# EAGLE design CircuitClockHandLayout (EAGLE 9.4.2)
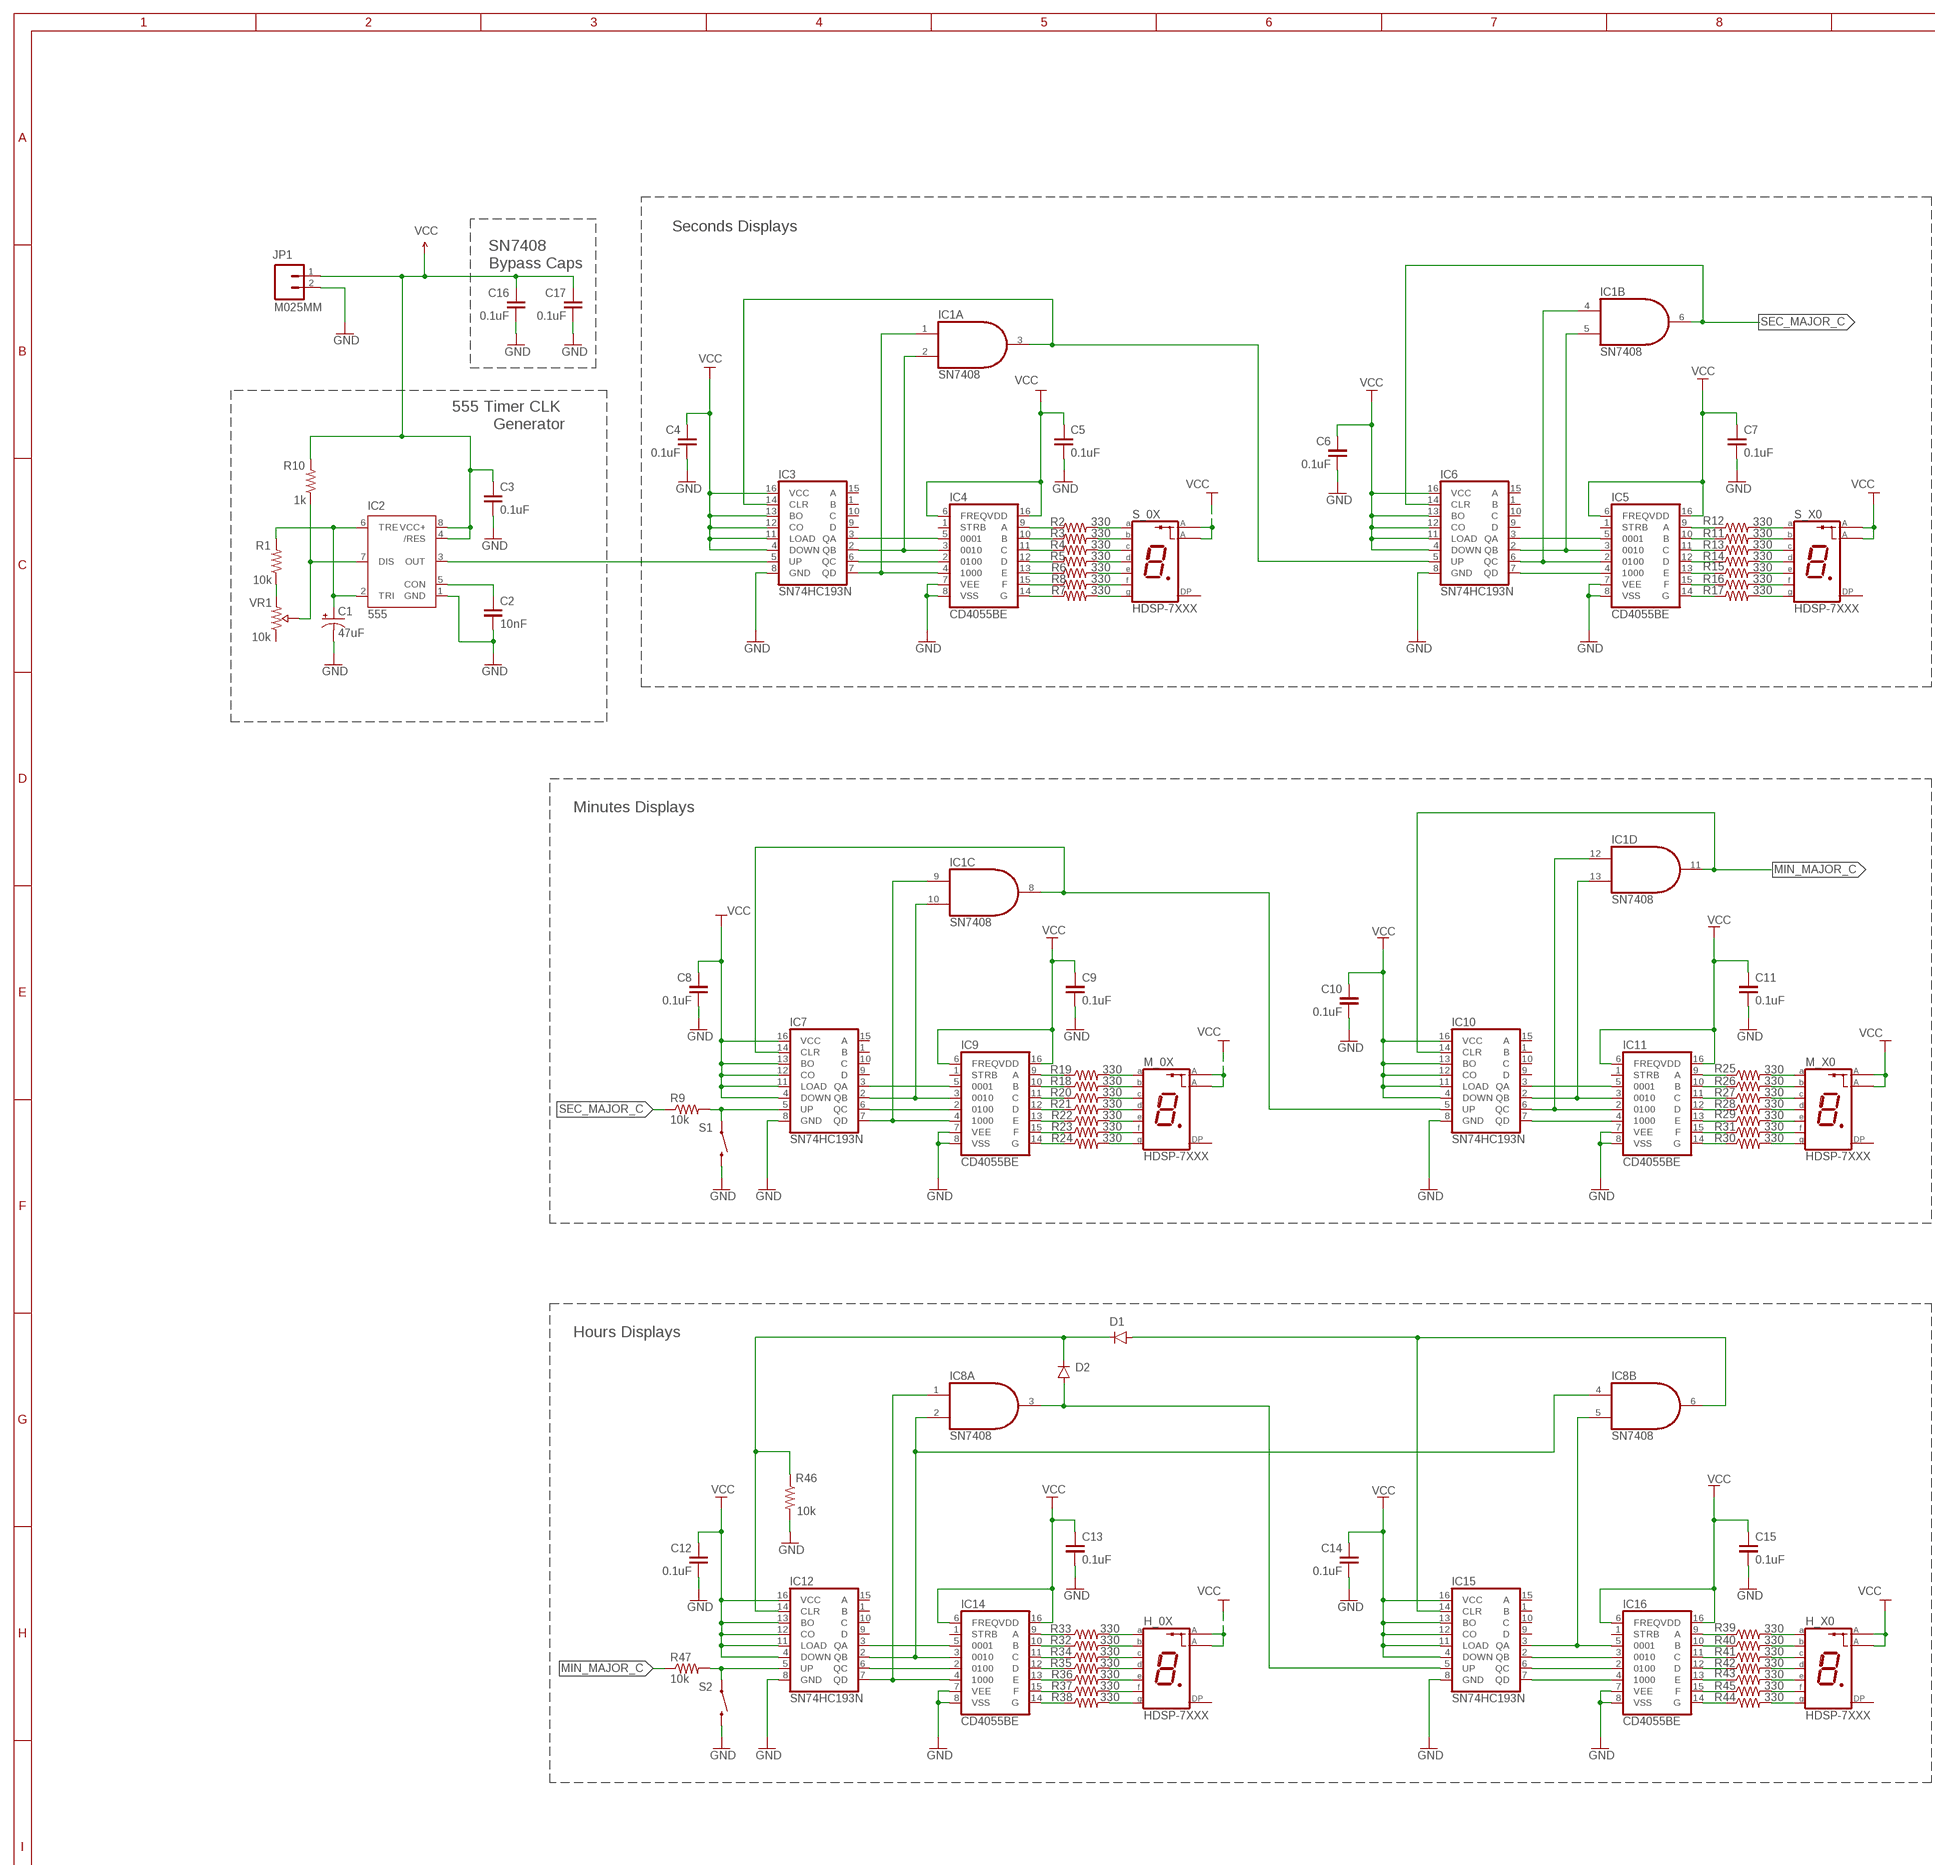
[diagram p0: schematic, sheet 1, part 1 of 2]
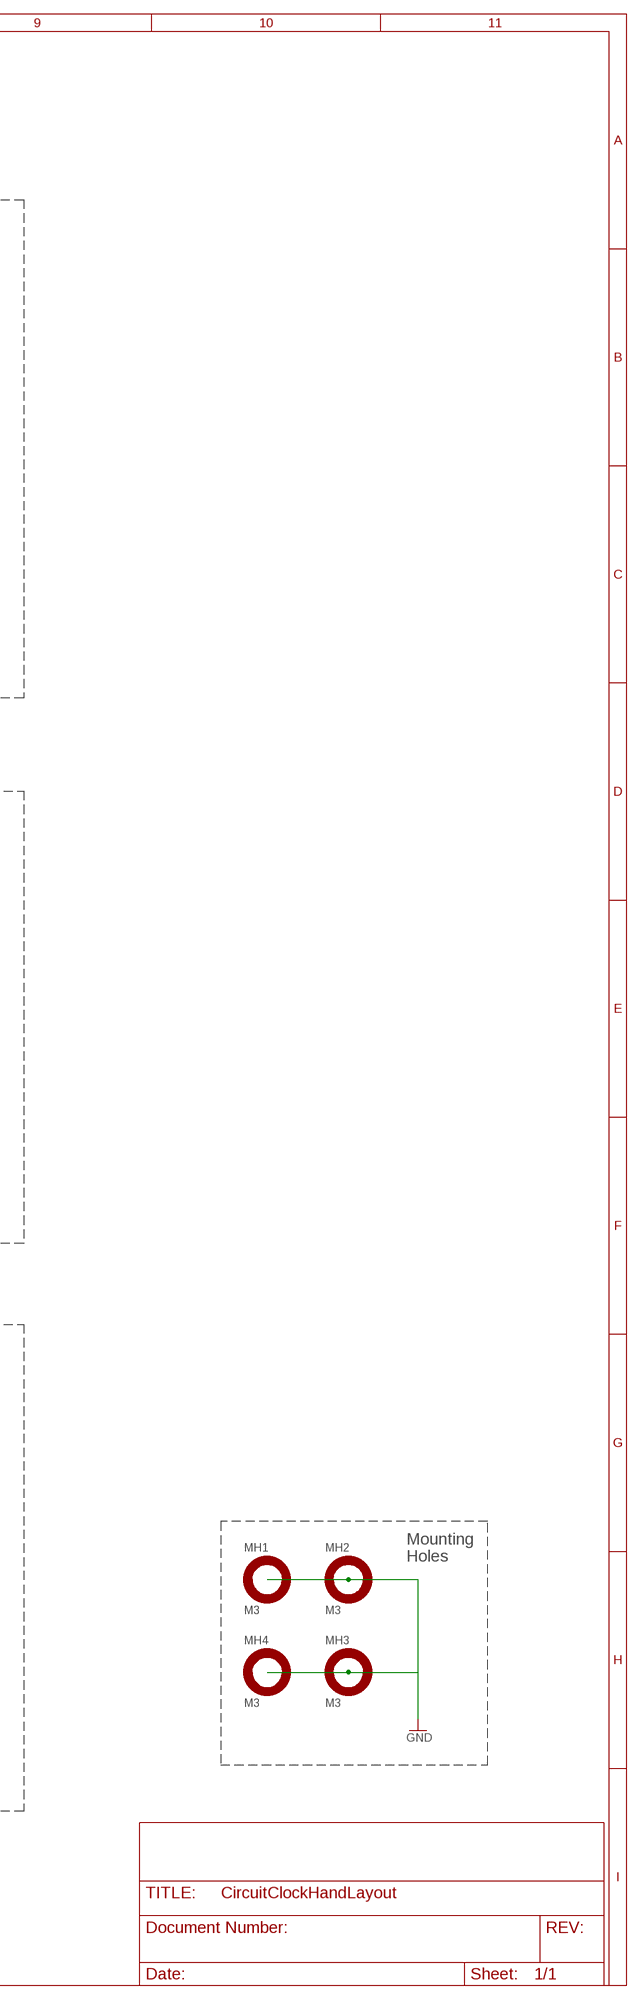
[diagram p1: schematic, sheet 1, part 2 of 2]
FRAME1 (FRAME_C_L): REV: 0

## Parts
C1  47uF  RADIAL_POL2.0MM_LEAD-5.0MM_DIA  [2.0MM_LEAD-5.0MM_DIA]
C2  10nF  NON_POL_2.5MM  [2.54MM_LEAD]
C3  0.1uF  NON_POL_2.5MM  [2.54MM_LEAD]
C4  0.1uF  NON_POL_2.5MM  [2.54MM_LEAD]
C5  0.1uF  NON_POL_2.5MM  [2.54MM_LEAD]
C6  0.1uF  NON_POL_2.5MM  [2.54MM_LEAD]
C7  0.1uF  NON_POL_2.5MM  [2.54MM_LEAD]
C8  0.1uF  NON_POL_2.5MM  [2.54MM_LEAD]
C9  0.1uF  NON_POL_2.5MM  [2.54MM_LEAD]
C10  0.1uF  NON_POL_2.5MM  [2.54MM_LEAD]
C11  0.1uF  NON_POL_2.5MM  [2.54MM_LEAD]
C12  0.1uF  NON_POL_2.5MM  [2.54MM_LEAD]
C13  0.1uF  NON_POL_2.5MM  [2.54MM_LEAD]
C14  0.1uF  NON_POL_2.5MM  [2.54MM_LEAD]
C15  0.1uF  NON_POL_2.5MM  [2.54MM_LEAD]
C16  0.1uF  NON_POL_2.5MM  [2.54MM_LEAD]
C17  0.1uF  NON_POL_2.5MM  [2.54MM_LEAD]
D1  THROUGH_HOLE_DO-35  [DO35-10]
D2  THROUGH_HOLE_DO-35  [DO35-10]
H_0X  HDSP-7XXX  [HDSP-7XXX]
H_X0  HDSP-7XXX  [HDSP-7XXX]
IC1  SN7408  74S08N  [DIL14]
IC2  555  555KIT  [DIP08-KIT]
IC3  SN74HC193N  [DIL16]
IC4  CD4055BE  [DIL16]
IC5  CD4055BE  [DIL16]
IC6  SN74HC193N  [DIL16]
IC7  SN74HC193N  [DIL16]
IC8  SN7408  74S08N  [DIL14]
IC9  CD4055BE  [DIL16]
IC10  SN74HC193N  [DIL16]
IC11  CD4055BE  [DIL16]
IC12  SN74HC193N  [DIL16]
IC14  CD4055BE  [DIL16]
IC15  SN74HC193N  [DIL16]
IC16  CD4055BE  [DIL16]
JP1  M025MM  [SCREWTERMINAL-5MM-2]
M_0X  HDSP-7XXX  [HDSP-7XXX]
M_X0  HDSP-7XXX  [HDSP-7XXX]
MH1  M3  MOUNT_HOLEM3  [M3]
MH2  M3  MOUNT_HOLEM3  [M3]
MH3  M3  MOUNT_HOLEM3  [M3]
MH4  M3  MOUNT_HOLEM3  [M3]
R1  10k  THROUGH_HOLE_1/4W_0.3  [1/4W_0.3]
R2  330  THROUGH_HOLE_1/4W_0.3  [1/4W_0.3]
R3  330  THROUGH_HOLE_1/4W_0.3  [1/4W_0.3]
R4  330  THROUGH_HOLE_1/4W_0.3  [1/4W_0.3]
R5  330  THROUGH_HOLE_1/4W_0.3  [1/4W_0.3]
R6  330  THROUGH_HOLE_1/4W_0.3  [1/4W_0.3]
R7  330  THROUGH_HOLE_1/4W_0.3  [1/4W_0.3]
R8  330  THROUGH_HOLE_1/4W_0.3  [1/4W_0.3]
R9  10k  THROUGH_HOLE_1/4W_0.3  [1/4W_0.3]
R10  1k  THROUGH_HOLE_1/4W_0.3  [1/4W_0.3]
R11  330  THROUGH_HOLE_1/4W_0.3  [1/4W_0.3]
R12  330  THROUGH_HOLE_1/4W_0.3  [1/4W_0.3]
R13  330  THROUGH_HOLE_1/4W_0.3  [1/4W_0.3]
R14  330  THROUGH_HOLE_1/4W_0.3  [1/4W_0.3]
R15  330  THROUGH_HOLE_1/4W_0.3  [1/4W_0.3]
R16  330  THROUGH_HOLE_1/4W_0.3  [1/4W_0.3]
R17  330  THROUGH_HOLE_1/4W_0.3  [1/4W_0.3]
R18  330  THROUGH_HOLE_1/4W_0.3  [1/4W_0.3]
R19  330  THROUGH_HOLE_1/4W_0.3  [1/4W_0.3]
R20  330  THROUGH_HOLE_1/4W_0.3  [1/4W_0.3]
R21  330  THROUGH_HOLE_1/4W_0.3  [1/4W_0.3]
R22  330  THROUGH_HOLE_1/4W_0.3  [1/4W_0.3]
R23  330  THROUGH_HOLE_1/4W_0.3  [1/4W_0.3]
R24  330  THROUGH_HOLE_1/4W_0.3  [1/4W_0.3]
R25  330  THROUGH_HOLE_1/4W_0.3  [1/4W_0.3]
R26  330  THROUGH_HOLE_1/4W_0.3  [1/4W_0.3]
R27  330  THROUGH_HOLE_1/4W_0.3  [1/4W_0.3]
R28  330  THROUGH_HOLE_1/4W_0.3  [1/4W_0.3]
R29  330  THROUGH_HOLE_1/4W_0.3  [1/4W_0.3]
R30  330  THROUGH_HOLE_1/4W_0.3  [1/4W_0.3]
R31  330  THROUGH_HOLE_1/4W_0.3  [1/4W_0.3]
R32  330  THROUGH_HOLE_1/4W_0.3  [1/4W_0.3]
R33  330  THROUGH_HOLE_1/4W_0.3  [1/4W_0.3]
R34  330  THROUGH_HOLE_1/4W_0.3  [1/4W_0.3]
R35  330  THROUGH_HOLE_1/4W_0.3  [1/4W_0.3]
R36  330  THROUGH_HOLE_1/4W_0.3  [1/4W_0.3]
R37  330  THROUGH_HOLE_1/4W_0.3  [1/4W_0.3]
R38  330  THROUGH_HOLE_1/4W_0.3  [1/4W_0.3]
R39  330  THROUGH_HOLE_1/4W_0.3  [1/4W_0.3]
R40  330  THROUGH_HOLE_1/4W_0.3  [1/4W_0.3]
R41  330  THROUGH_HOLE_1/4W_0.3  [1/4W_0.3]
R42  330  THROUGH_HOLE_1/4W_0.3  [1/4W_0.3]
R43  330  THROUGH_HOLE_1/4W_0.3  [1/4W_0.3]
R44  330  THROUGH_HOLE_1/4W_0.3  [1/4W_0.3]
R45  330  THROUGH_HOLE_1/4W_0.3  [1/4W_0.3]
R46  10k  THROUGH_HOLE_1/4W_0.3  [1/4W_0.3]
R47  10k  THROUGH_HOLE_1/4W_0.3  [1/4W_0.3]
S1  SWITCH-MOMENTARY-2PTH  [TACTILE-PTH]
S2  SWITCH-MOMENTARY-2PTH  [TACTILE-PTH]
S_0X  HDSP-7XXX  [HDSP-7XXX]
S_X0  HDSP-7XXX  [HDSP-7XXX]
VR1  10k  TRIM_POTS_BOURNS_3296  [3296]

## Nets
CLK: IC2.3(OUT) IC3.5(UP)
GND: C1.- C2.2 C3.2 C4.2 C5.2 C6.2 C7.2 C8.2 C9.2 C10.2 C11.2 C12.2 C13.2 C14.2 C15.2 C16.2 C17.2 IC2.1(GND) IC3.8(GND) IC4.7(VEE) IC4.8(VSS) IC5.7(VEE) IC5.8(VSS) IC6.8(GND) IC7.8(GND) IC9.7(VEE) IC9.8(VSS) IC10.8(GND) IC11.7(VEE) IC11.8(VSS) IC12.8(GND) IC14.7(VEE) IC14.8(VSS) IC15.8(GND) IC16.7(VEE) IC16.8(VSS) JP1.2 MH1.P$1 MH2.P$1 MH3.P$1 MH4.P$1 R46.P$2 S1.3 S2.3
HR_MAJOR_C: D1.C D2.C IC12.14(CLR) R46.P$1
HR_MINOR_C: D2.A IC8.3(A:O) IC15.5(UP)
HR_MINOR_UP: IC12.5(UP) R47.P$2 S2.1
MIN_MAJOR_C: IC1.11(D:O) IC10.14(CLR) R47.P$1
MIN_MINOR_C: IC1.8(C:O) IC7.14(CLR) IC10.5(UP)
MIN_MINOR_UP: IC7.5(UP) R9.P$2 S1.1
N$1: IC1.4(B:I0) IC5.2 IC6.6(QC)
N$2: IC2.7(DIS) R10.P$1 VR1.2(S)
N$3: IC3.3(QA) IC4.5
N$4: C2.1 IC2.5(CON)
N$5: IC1.2(A:I1) IC3.2(QB) IC4.3
N$6: IC1.5(B:I1) IC5.3 IC6.2(QB)
N$7: IC7.3(QA) IC9.5
N$8 [Power]: IC4.9(A) R2.P$1
N$9 [Power]: IC4.10(B) R3.P$1
N$10 [Power]: IC4.11(C) R4.P$1
N$11 [Power]: IC4.12(D) R5.P$1
N$12 [Power]: IC4.13(E) R6.P$1
N$13 [Power]: IC4.15(F) R8.P$1
N$14 [Power]: IC4.14(G) R7.P$1
N$16 [Power]: R2.P$2 S_0X.P$10(A)
N$17 [Power]: R3.P$2 S_0X.P$9(B)
N$18 [Power]: R4.P$2 S_0X.P$8(C)
N$19 [Power]: R5.P$2 S_0X.P$5(D)
N$20 [Power]: R6.P$2 S_0X.P$4(E)
N$21 [Power]: R8.P$2 S_0X.P$2(F)
N$22 [Power]: R7.P$2 S_0X.P$3(G)
N$23: R1.P$1 VR1.3(E)
N$24: C1.+ IC2.2(TRI) IC2.6(TRE) R1.P$2
N$25: IC1.1(A:I0) IC3.7(QD) IC4.4
N$26 [Power]: IC9.9(A) R19.P$1
N$27: IC5.4 IC6.7(QD)
N$28: IC5.5 IC6.3(QA)
N$29: IC3.6(QC) IC4.2
N$30 [Power]: IC5.9(A) R12.P$1
N$31 [Power]: IC5.10(B) R11.P$1
N$32 [Power]: IC5.11(C) R13.P$1
N$33 [Power]: IC5.12(D) R14.P$1
N$34 [Power]: IC5.13(E) R15.P$1
N$35 [Power]: IC5.15(F) R16.P$1
N$36 [Power]: IC5.14(G) R17.P$1
N$37 [Power]: R12.P$2 S_X0.P$10(A)
N$38 [Power]: R11.P$2 S_X0.P$9(B)
N$39 [Power]: R13.P$2 S_X0.P$8(C)
N$40 [Power]: R14.P$2 S_X0.P$5(D)
N$41 [Power]: R15.P$2 S_X0.P$4(E)
N$42 [Power]: R16.P$2 S_X0.P$2(F)
N$43 [Power]: R17.P$2 S_X0.P$3(G)
N$44 [Power]: IC9.10(B) R18.P$1
N$45 [Power]: IC9.11(C) R20.P$1
N$46 [Power]: IC9.12(D) R21.P$1
N$47 [Power]: IC9.13(E) R22.P$1
N$48 [Power]: IC9.15(F) R23.P$1
N$49 [Power]: IC9.14(G) R24.P$1
N$50 [Power]: M_0X.P$10(A) R19.P$2
N$51 [Power]: M_0X.P$9(B) R18.P$2
N$52 [Power]: M_0X.P$8(C) R20.P$2
N$53 [Power]: M_0X.P$5(D) R21.P$2
N$54 [Power]: M_0X.P$4(E) R22.P$2
N$55 [Power]: M_0X.P$2(F) R23.P$2
N$56 [Power]: M_0X.P$3(G) R24.P$2
N$57: IC10.3(QA) IC11.5
N$58 [Power]: IC11.9(A) R25.P$1
N$59 [Power]: IC11.10(B) R26.P$1
N$60 [Power]: IC11.11(C) R27.P$1
N$61 [Power]: IC11.12(D) R28.P$1
N$62 [Power]: IC11.13(E) R29.P$1
N$63 [Power]: IC11.15(F) R31.P$1
N$64 [Power]: IC11.14(G) R30.P$1
N$65 [Power]: M_X0.P$10(A) R25.P$2
N$66 [Power]: M_X0.P$9(B) R26.P$2
N$67 [Power]: M_X0.P$8(C) R27.P$2
N$68 [Power]: M_X0.P$5(D) R28.P$2
N$69 [Power]: M_X0.P$4(E) R29.P$2
N$70 [Power]: M_X0.P$2(F) R31.P$2
N$71 [Power]: M_X0.P$3(G) R30.P$2
N$72: IC10.7(QD) IC11.4
N$73: IC7.6(QC) IC9.2
N$74: IC1.12(D:I0) IC10.6(QC) IC11.2
N$75: IC1.13(D:I1) IC10.2(QB) IC11.3
N$76: IC1.9(C:I0) IC7.7(QD) IC9.4
N$77: IC1.10(C:I1) IC7.2(QB) IC9.3
N$80: IC12.3(QA) IC14.5
N$81 [Power]: IC14.9(A) R33.P$1
N$82 [Power]: IC14.10(B) R32.P$1
N$83 [Power]: IC14.11(C) R34.P$1
N$84 [Power]: IC14.12(D) R35.P$1
N$85 [Power]: IC14.13(E) R36.P$1
N$86 [Power]: IC14.15(F) R37.P$1
N$87 [Power]: IC14.14(G) R38.P$1
N$88 [Power]: H_0X.P$10(A) R33.P$2
N$89 [Power]: H_0X.P$9(B) R32.P$2
N$90 [Power]: H_0X.P$8(C) R34.P$2
N$91 [Power]: H_0X.P$5(D) R35.P$2
N$92 [Power]: H_0X.P$4(E) R36.P$2
N$93 [Power]: H_0X.P$2(F) R37.P$2
N$94 [Power]: H_0X.P$3(G) R38.P$2
N$96 [Power]: IC16.9(A) R39.P$1
N$97 [Power]: IC16.10(B) R40.P$1
N$98 [Power]: IC16.11(C) R41.P$1
N$99 [Power]: IC16.12(D) R42.P$1
N$100 [Power]: IC16.13(E) R43.P$1
N$101 [Power]: IC16.15(F) R45.P$1
N$102 [Power]: IC16.14(G) R44.P$1
N$103 [Power]: H_X0.P$10(A) R39.P$2
N$104 [Power]: H_X0.P$9(B) R40.P$2
N$105 [Power]: H_X0.P$8(C) R41.P$2
N$106 [Power]: H_X0.P$5(D) R42.P$2
N$107 [Power]: H_X0.P$4(E) R43.P$2
N$108 [Power]: H_X0.P$2(F) R45.P$2
N$109 [Power]: H_X0.P$3(G) R44.P$2
N$110: IC15.7(QD) IC16.4
N$111: IC12.6(QC) IC14.2
N$112: IC15.6(QC) IC16.2
N$113: IC15.2(QB) IC16.3
N$114: IC8.1(A:I0) IC12.7(QD) IC14.4
N$115: IC8.2(A:I1) IC8.4(B:I0) IC12.2(QB) IC14.3
N$117: D1.A IC8.6(B:O) IC15.14(CLR)
N$118: IC8.5(B:I1) IC15.3(QA) IC16.5
SEC_MAJOR_C: IC1.6(B:O) IC6.14(CLR) R9.P$1
SEC_MINOR_C: IC1.3(A:O) IC3.14(CLR) IC6.5(UP)
VCC [Power]: C3.1 C4.1 C5.1 C6.1 C7.1 C8.1 C9.1 C10.1 C11.1 C12.1 C13.1 C14.1 C15.1 C16.1 C17.1 H_0X.P$1(A) H_0X.P$6(A) H_X0.P$1(A) H_X0.P$6(A) IC2.4(/RES) IC2.8(VCC+) IC3.4(DOWN) IC3.11(LOAD) IC3.12(CO) IC3.13(BO) IC3.16(VCC) IC4.6(FREQ) IC4.16(VDD) IC5.6(FREQ) IC5.16(VDD) IC6.4(DOWN) IC6.11(LOAD) IC6.12(CO) IC6.13(BO) IC6.16(VCC) IC7.4(DOWN) IC7.11(LOAD) IC7.12(CO) IC7.13(BO) IC7.16(VCC) IC9.6(FREQ) IC9.16(VDD) IC10.4(DOWN) IC10.11(LOAD) IC10.12(CO) IC10.13(BO) IC10.16(VCC) IC11.6(FREQ) IC11.16(VDD) IC12.4(DOWN) IC12.11(LOAD) IC12.12(CO) IC12.13(BO) IC12.16(VCC) IC14.6(FREQ) IC14.16(VDD) IC15.4(DOWN) IC15.11(LOAD) IC15.12(CO) IC15.13(BO) IC15.16(VCC) IC16.6(FREQ) IC16.16(VDD) JP1.1 M_0X.P$1(A) M_0X.P$6(A) M_X0.P$1(A) M_X0.P$6(A) R10.P$2 S_0X.P$1(A) S_0X.P$6(A) S_X0.P$1(A) S_X0.P$6(A) ; supply symbol labelled SINK_UNDEFINED, SUPPLY_UNDEFINED
Unconnected: H_0X.P$7(DP) H_X0.P$7(DP) IC3.1(B) IC3.9(D) IC3.10(C) IC3.15(A) IC4.1(STRB) IC5.1(STRB) IC6.1(B) IC6.9(D) IC6.10(C) IC6.15(A) IC7.1(B) IC7.9(D) IC7.10(C) IC7.15(A) IC8.8(C:O) IC8.9(C:I0) IC8.10(C:I1) IC8.11(D:O) IC8.12(D:I0) IC8.13(D:I1) IC9.1(STRB) IC10.1(B) IC10.9(D) IC10.10(C) IC10.15(A) IC11.1(STRB) IC12.1(B) IC12.9(D) IC12.10(C) IC12.15(A) IC14.1(STRB) IC15.1(B) IC15.9(D) IC15.10(C) IC15.15(A) IC16.1(STRB) M_0X.P$7(DP) M_X0.P$7(DP) S_0X.P$7(DP) S_X0.P$7(DP) VR1.1(A)

## Notes on the sheet
- Seconds Displays
- SN7408
  Bypass Caps
- 555 Timer CLK 
  Generator
- Minutes Displays
- Hours Displays
- Mounting
  Holes

## Power pins joined to a net without a drawn wire
GND: IC1.7(P:GND) IC8.7(P:GND)
VCC: IC1.14(P:VCC) IC8.14(P:VCC)

## Library data of the parts
C1 = Capacitors:RADIAL_POL
C2-C17 = Capacitors:NON_POL
D1 D2 = Diodes:THROUGH_HOLE: DIODE silicon-epitaxial planar diode
H_0X H_X0 M_0X M_X0 S_0X S_X0 = led-7-segment:HDSP-7XXX
IC1 IC8 = 74xx-us:74*08: Quad 2-input AND gate
IC2 = SparkFun-IC-Special-Function:555: General purpose bipolar Timer Datasheet <http://www.sparkfun.com/datasheets/Components/General/ne555.pdf> SparkFun Products SparkFun SparkPunk Sequencer Kit <https://www.sparkfun.com/products/12707> (KIT-12707) Storefront Component: 555 Timer <https://www.sparkfun.com/products/9273> (COM-09273) Two parts valid for production: VFP: IC-11930 (M7555 PTH) VFP: IC-09173 (555 PTH) - Preferred; PROD_ID: IC-09173; PROD_ID_ALT: IC-11930
IC3 IC6 IC7 IC10 IC12 IC15 = ICs:SN74HC193N
IC4 IC5 IC9 IC11 IC14 IC16 = ICs:CD4055BE
JP1 = SparkFun-Connectors:M02: Standard 2-pin 0.1" header. Use with - straight break away headers ( PRT-00116) - right angle break away headers (PRT-00553) - swiss pins (PRT-00743) - machine pins (PRT-00117) - female headers (PRT-00115) Molex polarized connector foot print use with: PRT-08233 with associated crimp pins and housings. 2.54_SCREWTERM for use with PRT-10571. 3.5mm Screw Terminal footprints for PRT-08084 5mm Screw Terminal footprints for use with PRT-08432; STOREFRONT_ID: PRT-08432
MH1-MH4 = hardware:MOUNT_HOLE
R1-R47 = Resistors:THROUGH_HOLE
S1 S2 = SparkFun-Electromechanical:SWITCH-MOMENTARY-2: Various NO switches- pushbuttons, reed, etc
VR1 = Potentiometer:TRIM_POTS

## Net classes
0 default: width 0.203 mm, clearance 0.203 mm
1 Power: width 0.305 mm, clearance 0.203 mm to class 0, clearance 0.203 mm

## Board
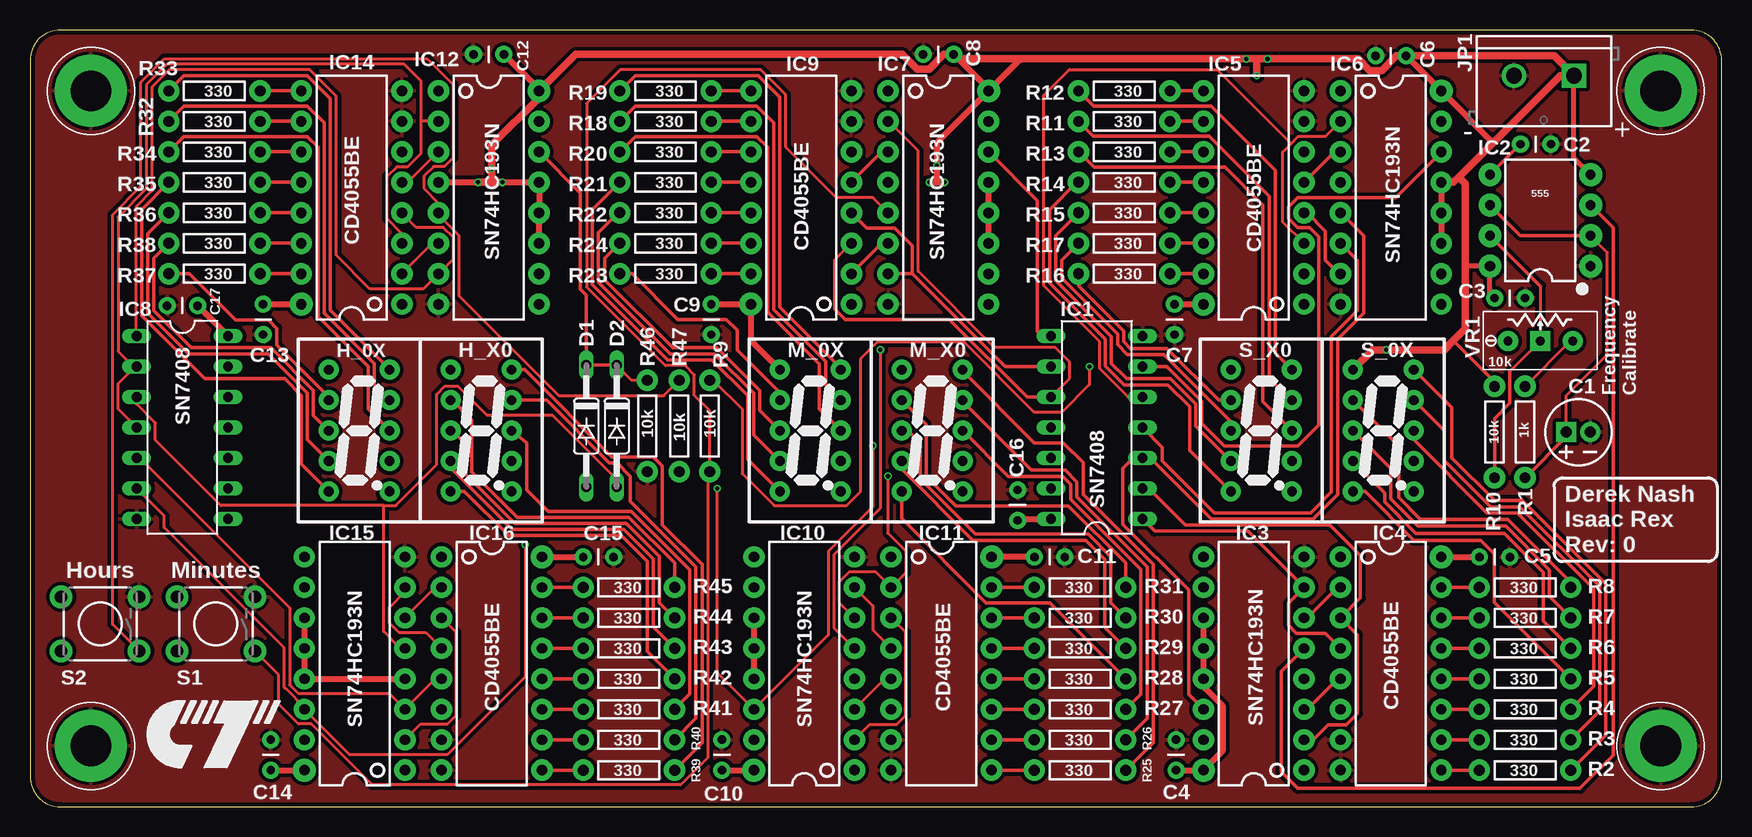
[diagram p2: board, top side]
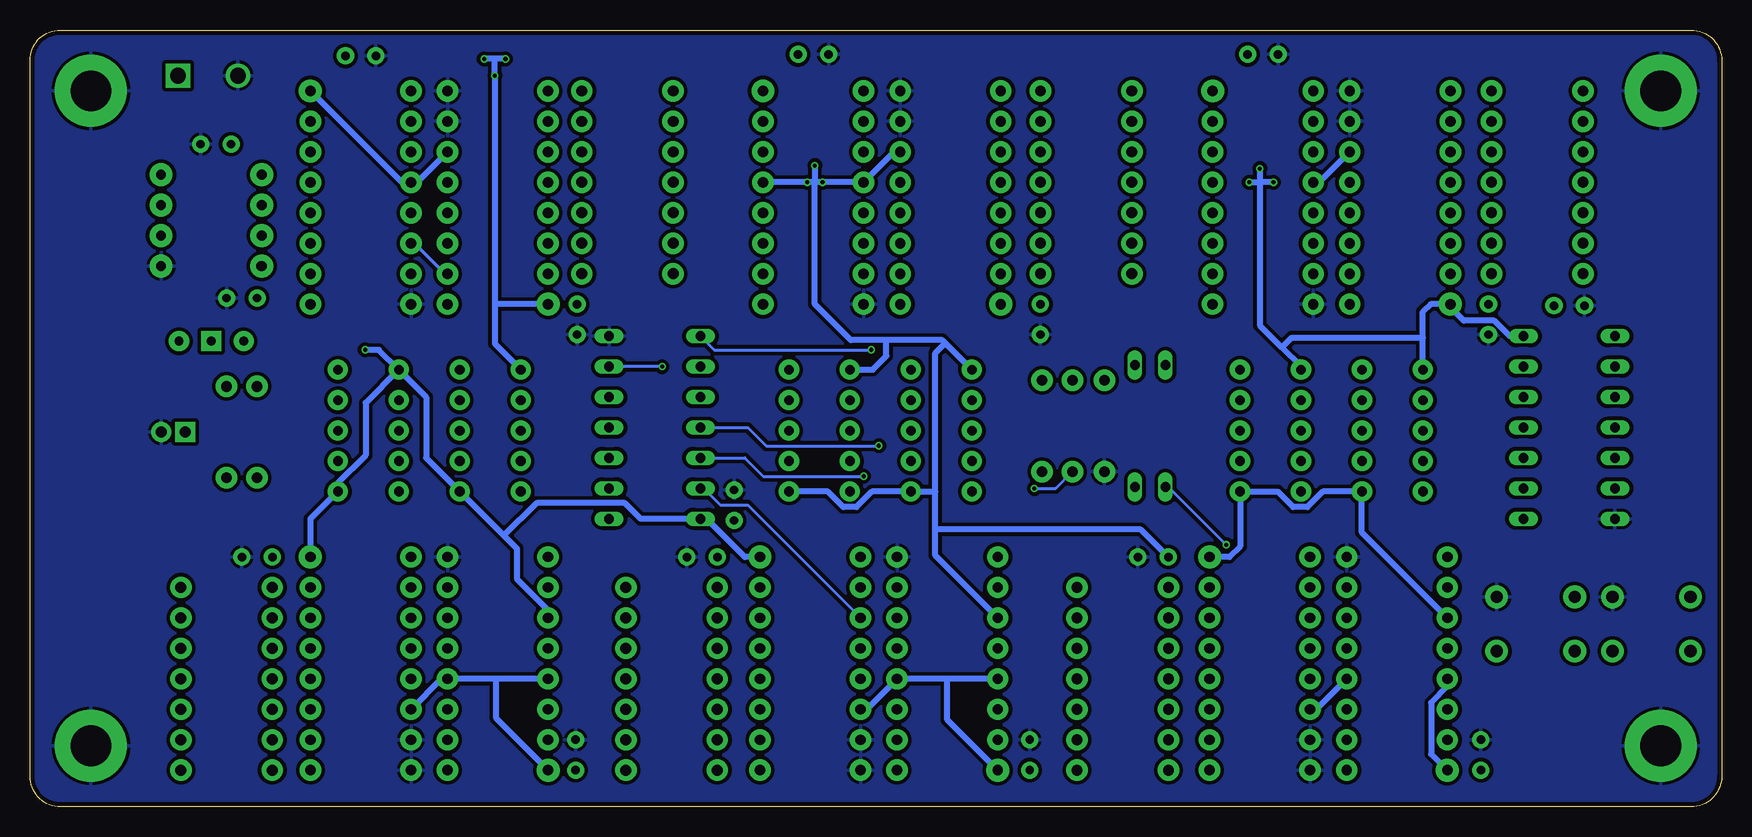
[diagram p3: board, bottom side, seen from below]

Size 140.97 x 64.77 mm. Coordinates in mm from the lower left corner, seen from the top.
Outline: 2.54,64.77 arc90 0,62.23 0,2.54 arc90 2.54,0 138.43,0 arc90 140.97,2.54 140.97,62.23 arc90 138.43,64.77 2.54,64.77
Copper layers (1*16): Top 0.035559375mm / dielectric 1.6mm / Bottom 0.035559375mm
Design rules "OshPark-2layer *": minimum track width 8mil, minimum drill 10mil, track to track 8mil, track to pad 8mil, pad to pad 8mil, via to via 8mil, smd to smd 6mil, copper to edge 15mil, drill to drill 6mil, minimum pad ring 5mil, minimum via ring 5mil, stop-mask expansion 2.5mil, vias tented up to drill 0mil, thermal gap 10mil

### Footprints (pad centres in the part's own frame; a part is rotated, then mirrored left to right if it is on the bottom)
2.0MM_LEAD-5.0MM_DIA = drill 0.9 pad 1.676 square: + 1,0 | drill 0.9 pad 1.676: - -1,0
2.54MM_LEAD = drill 0.7 pad 1.422: 1 -1.27,0; 2 1.27,0
DO35-10 = drill 0.813 long: A 5.08,0; C -5.08,0
HDSP-7XXX = drill 0.8 pad 1.676: P$1 -2.54,5.08; P$2 -2.54,2.54; P$3 -2.54,0; P$4 -2.54,-2.54; P$5 -2.54,-5.08; P$6 2.54,-5.08; P$7 2.54,-2.54; P$8 2.54,0; P$9 2.54,2.54; P$10 2.54,5.08
DIL14 = drill 0.813 long: 1 -7.62,-3.81; 2 -5.08,-3.81; 3 -2.54,-3.81; 4 0,-3.81; 5 2.54,-3.81; 6 5.08,-3.81; 7 7.62,-3.81; 8 7.62,3.81; 9 5.08,3.81; 10 2.54,3.81; 11 0,3.81; 12 -2.54,3.81; 13 -5.08,3.81; 14 -7.62,3.81
DIP08-KIT = drill 0.813 pad 1.905: 1 -3.81,-4.191; 2 -1.27,-4.191; 3 1.27,-4.191; 4 3.81,-4.191; 5 3.81,4.191; 6 1.27,4.191; 7 -1.27,4.191 | drill 0.864 pad 1.905: 8 -3.81,4.191
DIL16 = drill 0.864 pad 1.778: 1 -8.89,-4.191; 2 -6.35,-4.191; 3 -3.81,-4.191; 4 -1.27,-4.191; 5 1.27,-4.191; 6 3.81,-4.191; 7 6.35,-4.191; 8 8.89,-4.191; 9 8.89,4.191; 10 6.35,4.191; 11 3.81,4.191; 12 1.27,4.191; 13 -1.27,4.191; 14 -3.81,4.191; 15 -6.35,4.191 | drill 0.864 pad 1.905: 16 -8.89,4.191
SCREWTERMINAL-5MM-2 = drill 1.3 pad 2.032 square: 1 0,0 | drill 1.3 pad 2.032: 2 5,0
M3 = drill 3.4 pad 6: P$1 0,0
1/4W_0.3 = drill 0.9 pad 1.778: P$1 -3.81,0; P$2 3.81,0
TACTILE-PTH = drill 1.016 pad 1.88: 1 -3.251,2.261; 2 3.251,2.261; 3 -3.251,-2.261; 4 3.251,-2.261
3296 = drill 0.737 pad 1.676: 1 -2.692,-0.035; 3 2.692,-0.035 | drill 0.737 pad 1.676 square: 2 0,-0.035

### Placement (x,y rotation side)
C1  129.03,31.24 180 top
C2  125.48,55.24 0 top
C3  123.32,42.42 0 top
C4  95.5,4.32 90 top
C5  122.05,20.83 0 top
C6  113.41,62.61 180 top
C7  95.38,40.64 270 top
C8  75.69,62.74 180 top
C9  56.77,40.64 270 top
C10  57.66,4.32 90 top
C11  84.96,20.83 0 top
C12  38.23,62.74 180 top
C13  19.43,40.64 270 top
C14  20.07,4.32 90 top
C15  47.37,20.83 0 top
C16  82.3,25.15 90 top
C17  12.7,41.78 180 top
D1  46.35,31.75 270 top
D2  48.9,31.75 270 top
H_0X  27.43,31.37 0 top
H_X0  37.59,31.37 0 top
IC1  88.9,31.62 90 top
IC2  125.86,48.9 90 top
IC3  101.98,11.94 90 top
IC4  113.41,11.94 270 top
IC5  101.98,50.8 90 top
IC6  113.41,50.8 270 top
IC7  75.69,50.8 270 top
IC8  12.7,31.62 270 top
IC9  64.26,50.8 90 top
IC10  64.52,11.94 90 top
IC11  75.95,11.94 270 top
IC12  38.23,50.8 270 top
IC14  26.8,50.8 90 top
IC15  27.05,11.94 90 top
IC16  38.48,11.94 270 top
JP1  128.65,60.96 180 top
M_0X  65.02,31.37 0 top
M_X0  75.18,31.37 0 top
MH1  5.08,59.69 0 top
MH2  5.08,5.08 0 top
MH3  135.89,5.08 0 top
MH4  135.89,59.69 0 top
R1  124.59,31.24 270 top
R2  124.59,3.05 0 top
R3  124.59,5.59 0 top
R4  124.59,8.13 0 top
R5  124.59,10.67 0 top
R6  124.59,13.21 0 top
R7  124.59,15.75 0 top
R8  124.59,18.29 0 top
R9  56.64,31.75 270 top
R10  122.05,31.24 90 top
R11  91.19,57.15 180 top
R12  91.19,59.69 180 top
R13  91.19,54.61 180 top
R14  91.19,52.07 180 top
R15  91.19,49.53 180 top
R16  91.19,44.45 180 top
R17  91.19,46.99 180 top
R18  52.96,57.15 180 top
R19  52.96,59.69 180 top
R20  52.96,54.61 180 top
R21  52.96,52.07 180 top
R22  52.96,49.53 180 top
R23  52.96,44.45 180 top
R24  52.96,46.99 180 top
R25  87.5,3.05 0 top
R26  87.5,5.59 0 top
R27  87.5,8.13 0 top
R28  87.5,10.67 0 top
R29  87.5,13.21 0 top
R30  87.5,15.75 0 top
R31  87.5,18.29 0 top
R32  15.37,57.15 180 top
R33  15.37,59.69 180 top
R34  15.37,54.61 180 top
R35  15.37,52.07 180 top
R36  15.37,49.53 180 top
R37  15.37,44.45 180 top
R38  15.37,46.99 180 top
R39  49.91,3.05 0 top
R40  49.91,5.59 0 top
R41  49.91,8.13 0 top
R42  49.91,10.67 0 top
R43  49.91,13.21 0 top
R44  49.91,15.75 0 top
R45  49.91,18.29 0 top
R46  51.44,31.75 270 top
R47  54.1,31.75 90 top
S1  15.49,15.24 180 top
S2  5.84,15.24 180 top
S_0X  112.78,31.37 0 top
S_X0  102.62,31.37 0 top
VR1  125.86,38.86 0 top

### Tracks (layer width: path | path; a pad name or v marks a point on that pad's centre or on a via)
CLK
  Top 0.254: IC2.3 130.18,50.04
  Top 0.305: IC3.5 104.27,11.3 104.27,2.92 105.66,1.52 129.16,1.52 131.93,4.29 131.93,48.28 130.18,50.04
GND
  pour Bottom (isolate 0.305): 0,0 0,64.77 141.1,64.77 141.1,0
  pour Top (isolate 0.305): 141.1,0 141.1,64.77 0,64.77 0,0
HR_MAJOR_C
  Top 0.254: R46.P$1 50.16,35.56 D2.C
  Top 0.305: D2.C D1.C 46.35,42.67 45.85,43.18 45.85,51.18 IC12.14
HR_MINOR_C
  Top 0.254: 29.46,25.12 30.48,25.12 33.88,28.52 33.88,34.39 34.57,35.08 35.66,35.08 38.08,32.66 43.54,32.66 48.9,27.3 D2.A | IC15.5 30.86,13.21 29.46,14.61 29.46,25.12 | IC8.3 8.89,33.56 10.44,32.01 10.44,30.58 15.9,25.12 29.46,25.12
HR_MINOR_UP
  Top 0.254: S2.1 6.88,15.19 6.88,49.37 9.25,51.73 9.25,60.4 11.21,62.36 33.09,62.36 35.26,60.2 35.26,54.1 34.54,53.39 33.63,53.39 32.82,52.58 32.82,51.56 34.04,50.35 IC12.5 34.16,49.4 34.16,49.23 35.76,47.63 35.76,42.6 44.07,34.29 52.83,34.29 R47.P$2
MIN_MAJOR_C  (via drill 0.35)
  Top 0.254: v70.23,30.1 70.23,25.02 66.52,21.31 66.52,14.33 IC10.14 57.28,11.18 v57.28,26.54
  Bottom 0.254: IC1.11 81.15,31.62 79.63,30.1 v70.23,30.1 | v57.28,26.54 55.5,26.54 R47.P$1
MIN_MINOR_C  (via drill 0.35)
  Top 0.254: v70.87,38.1 70.87,24.89 66.98,21.01 66.98,14.94 IC10.5
  Top 0.305: IC1.8 84.33,39.24 83.95,39.62 83.95,50.55 IC7.14
  Bottom 0.254: IC1.8 83.95,38.1 v70.87,38.1
MIN_MINOR_UP
  Top 0.254: IC7.5 70.23,50.8 67.18,50.8 62.97,55.02 62.97,59.38 60.91,61.44 49.18,61.44 46.38,58.65 46.38,43.34 52.94,36.78 54.61,36.78 55.37,36.01 55.37,34.29 56.64,33.02 R9.P$2 56.49,27.79 56.49,4.09 54.23,1.83 28.51,1.83 23.43,6.91 22.36,6.91 20.73,8.54 20.73,11 S1.1
N$1
  Top 0.305: IC1.4 94.36,29.97 94.36,28.83 98.68,24.51 106.72,24.51 108.46,26.25 108.46,39.2 110.62,41.36 110.62,45.59 IC6.6
  Bottom 0.305: IC6.6 108.97,46.99 106.43,44.45 IC5.2
N$2
  Top 0.254: 123.32,36.29 125.43,38.4 VR1.2 125.86,43.43
  Top 0.305: IC2.7 125.86,43.43 | R10.P$1 122.05,32.38 123.32,33.66 123.32,36.29
N$3
  Top 0.305: IC3.3 106.43,8.13 108.97,10.67 IC4.5
N$4
  Top 0.305: IC2.5 C2.1
N$5
  Top 0.305: IC3.2 106.93,5.59 108.18,6.83 109.69,6.83 110.62,7.76 110.62,14.35 IC4.3 110.87,17.4 110.87,20.94 108.31,23.5 96.27,23.5 93.09,26.67 92.84,26.67 IC1.2
N$6
  Top 0.254: IC5.3 104.39,48.77 104.39,54.59 105.1,55.3 | 105.1,55.3 105.71,55.91 107.97,55.91 IC6.2 | IC1.5 91.51,34.16 89.13,36.55 89.13,38.8 84.48,43.45 84.48,59.33 86.61,61.47 98.93,61.47 105.1,55.3
N$7
  Top 0.305: IC9.5 70.99,54.61 IC7.3
N$8
  Top 0.305: IC4.9 R2.P$1
N$9
  Top 0.305: IC4.10 R3.P$1
N$10
  Top 0.305: IC4.11 R4.P$1
N$11
  Top 0.305: IC4.12 R5.P$1
N$12
  Top 0.305: IC4.13 R6.P$1
N$13
  Top 0.305: IC4.15 R8.P$1
N$14
  Top 0.305: IC4.14 R7.P$1
N$16
  Top 0.305: S_0X.P$10 118.49,33.27 118.49,29.08 122.05,25.53 124.37,25.53 131.32,18.58 131.32,5.97 R2.P$2
N$17
  Top 0.305: S_0X.P$9 117.86,31.37 117.86,28.88 121.71,25.02 124.16,25.02 130.81,18.37 130.81,8 R3.P$2
N$18
  Top 0.305: R4.P$2 130.3,10.03 130.3,18.16 123.95,24.51 121.41,24.51 115.32,30.61 S_0X.P$8
N$19
  Top 0.305: R5.P$2 122.02,17.04 122.02,21.09 120.89,22.23 115.32,22.23 111.25,26.29 S_0X.P$5
N$20
  Top 0.305: S_0X.P$4 112.9,26.16 112.9,25.4 115.49,22.81 122.86,22.81 126.11,19.56 126.11,15.49 R6.P$2
N$21
  Top 0.305: S_0X.P$2 114.05,30.1 114.05,25.78 115.85,23.98 123.13,23.98 128.4,18.71 R8.P$2
N$22
  Top 0.305: S_0X.P$3 113.41,28.19 113.41,25.65 115.66,23.4 122.99,23.4 126.62,19.77 126.62,17.53 R7.P$2
N$23
  Top 0.254: R1.P$1 128.36,38.83 VR1.3
N$24
  Top 0.254: C1.+ 128.03,34.31 131.44,37.72 131.44,46.23 IC2.2
  Top 0.305: IC2.6 124.21,47.62 IC2.2 | R1.P$2 128.03,30.88 C1.+
N$25
  Top 0.305: IC4.4 107.95,14.48 105.54,14.48 104.9,15.11 104.9,17.02 IC3.7 101.47,22.99 93.73,22.99 IC1.1
N$26
  Top 0.305: R19.P$1 IC9.9
N$27
  Top 0.305: IC6.7 109.09,44.45 107.95,45.59 107.95,48.01 106.43,49.53 IC5.4
N$28
  Top 0.305: IC5.5 108.71,54.61 IC6.3
N$29
  Top 0.305: IC3.6 106.43,15.75 108.97,18.29 IC4.2
N$30
  Top 0.305: R12.P$1 IC5.9
N$31
  Top 0.305: R11.P$1 IC5.10
N$32
  Top 0.305: R13.P$1 IC5.11
N$33
  Top 0.305: R14.P$1 IC5.12
N$34
  Top 0.305: R15.P$1 IC5.13
N$35
  Top 0.305: R16.P$1 IC5.15
N$36
  Top 0.305: R17.P$1 IC5.14
N$37
  Top 0.305: S_X0.P$10 103.76,37.85 103.76,53.09 98.42,58.42 88.65,58.42 R12.P$2
N$38
  Top 0.305: S_X0.P$9 105.03,33.91 103.25,35.69 103.25,50.93 98.27,55.91 88.62,55.91 R11.P$2
N$39
  Top 0.305: S_X0.P$8 102.74,33.78 102.74,50.16 99.59,53.31 88.67,53.31 R13.P$2
N$40
  Top 0.305: R14.P$2 87.25,52.07 84.96,49.78 84.96,43.65 89.61,39 89.61,36.75 91.18,35.18 94.83,35.18 96.65,33.36 96.65,29.72 S_X0.P$5
N$41
  Top 0.305: R15.P$2 85.47,47.62 85.47,43.86 90.12,39.21 90.12,36.96 91.39,35.69 95.04,35.69 97.16,33.57 97.16,31.75 S_X0.P$4
N$42
  Top 0.305: S_X0.P$2 99.06,33.91 94.74,38.23 91.69,38.23 91.14,38.79 91.14,39.67 87.38,43.43 R16.P$2
N$43
  Top 0.305: R17.P$2 85.98,45.59 85.98,44.07 90.63,39.42 90.63,38.53 91.44,37.72 94.49,37.72 100.08,32.13 S_X0.P$3
N$44
  Top 0.305: IC9.10 R18.P$1
N$45
  Top 0.305: R20.P$1 IC9.11
N$46
  Top 0.305: IC9.12 R21.P$1
N$47
  Top 0.305: R22.P$1 IC9.13
N$48
  Top 0.305: R23.P$1 IC9.15
N$49
  Top 0.305: R24.P$1 IC9.14
N$50
  Top 0.305: M_0X.P$10 67.56,36.58 62.48,41.66 62.48,59.18 60.71,60.96 50.42,60.96 R19.P$2
N$51
  Top 0.305: M_0X.P$9 66.29,35.18 66.29,37.13 61.98,41.45 61.98,57.02 60.58,58.42 50.42,58.42 R18.P$2
N$52
  Top 0.305: M_0X.P$8 65.79,33.15 65.79,36.92 61.47,41.23 61.47,54.99 60.58,55.88 50.42,55.88 R20.P$2
N$53
  Top 0.305: M_0X.P$5 59.82,28.96 59.82,34.27 56.83,37.26 53.14,37.26 46.86,43.54 46.86,49.78 R21.P$2
N$54
  Top 0.305: R22.P$2 49.04,49.53 47.37,47.86 47.37,43.75 53.35,37.77 57.04,37.77 60.33,34.48 60.33,30.99 M_0X.P$4
N$55
  Top 0.305: R23.P$2 50.18,44.45 53.99,40.64 58.04,40.64 58.93,39.75 58.93,38.1 62.48,34.54 M_0X.P$2
N$56
  Top 0.305: R24.P$2 47.9,45.74 47.9,43.93 53.56,38.28 57.25,38.28 60.83,34.69 60.83,33.02 M_0X.P$3
N$57
  Top 0.254: IC10.3 71.25,10.67 IC11.5
N$58
  Top 0.305: IC11.9 R25.P$1
N$59
  Top 0.305: IC11.10 R26.P$1
N$60
  Top 0.305: IC11.11 R27.P$1
N$61
  Top 0.305: IC11.12 R28.P$1
N$62
  Top 0.305: IC11.13 R29.P$1
N$63
  Top 0.305: IC11.15 R31.P$1
N$64
  Top 0.305: IC11.14 R30.P$1
N$65
  Top 0.305: R25.P$2 93.6,5.33 93.6,20.19 87.76,26.03 87.76,28.7 86.11,30.35 83.69,30.35 77.72,36.32 M_X0.P$10
N$66
  Top 0.305: R26.P$2 93.09,7.37 93.09,19.98 87.25,25.82 87.25,27.08 86.26,28.07 83.44,28.07 77.72,33.78 M_X0.P$9
N$67
  Top 0.305: R27.P$2 92.56,9.37 92.56,19.79 86.74,25.61 86.74,26.87 86.05,27.56 81.53,27.56 M_X0.P$8
N$68
  Top 0.305: R28.P$2 84.96,17.02 79.65,17.02 72.64,24.02 M_X0.P$5
N$69
  Top 0.305: R29.P$2 89.56,14.96 89.56,20.64 87.97,22.23 78.57,22.23 72.64,28.15 M_X0.P$4
N$70
  Top 0.305: R31.P$2 91.31,20.32 86.54,25.09 77.14,25.09 74.68,27.56 74.68,31.88 M_X0.P$2
N$71
  Top 0.305: R30.P$2 90.07,16.99 90.07,20.85 88.18,22.73 78.78,22.73 74.17,27.35 74.17,30.35 73.15,31.37 M_X0.P$3
N$72
  Top 0.254: IC10.7 70.23,16.76 70.23,14.73 IC11.4
N$73
  Top 0.305: IC9.2 70.99,46.99 IC7.6
N$74  (via drill 0.35)
  Top 0.254: v71.5,27.56 71.48,27.53 71.48,22.83 72.97,21.33 72.97,19.51 IC11.2 70.43,19.61 68.3,19.61 67.44,18.74 67.44,17.02 IC10.6
  Bottom 0.254: IC1.12 81.41,29.08 79.88,27.56 v71.5,27.56
N$75
  Top 0.254: IC11.3 72.97,14.53 72.97,7.62 72.21,6.86 69.98,6.86 IC10.2
  Bottom 0.254: IC1.13 84.84,26.54 83.44,25.15 81.15,25.15 IC11.3
N$76
  Top 0.305: IC1.9 81.28,36.7 73.53,44.45 | 73.53,44.45 IC7.7 | IC9.4 69.72,48.26 72.05,48.26 73.53,46.78 73.53,44.45
N$77
  Top 0.254: 67.08,41.5 67.08,45.62 IC9.3 | IC1.10 86.64,35.71 86.64,37.09 85.43,38.3 80.36,38.3 74.02,44.65 74.02,54.71 71.57,57.15 IC7.2
  Top 0.305: IC1.10 83.1,34.16 76.62,40.64 67.94,40.64 67.08,41.5
N$80
  Top 0.254: IC12.3 31.5,52.07 IC14.5
N$81
  Top 0.305: R33.P$1 IC14.9
N$82
  Top 0.305: IC14.10 R32.P$1
N$83
  Top 0.305: R34.P$1 IC14.11
N$84
  Top 0.305: IC14.12 R35.P$1
N$85
  Top 0.305: R36.P$1 IC14.13
N$86
  Top 0.305: R37.P$1 IC14.15
N$87
  Top 0.305: IC14.14 R38.P$1
N$88
  Top 0.305: R33.P$2 12.83,60.96 23.11,60.96 25.02,59.05 25.02,41.4 H_0X.P$10
N$89
  Top 0.305: R32.P$2 12.83,58.42 23.11,58.42 24.51,57.02 24.51,41.15 28.7,36.96 28.7,35.18 H_0X.P$9
N$90
  Top 0.305: R34.P$2 12.83,55.88 23.11,55.88 24,54.99 24,40.89 28.19,36.7 28.19,33.15 H_0X.P$8
N$91
  Top 0.305: R35.P$2 9.3,49.81 9.3,40.97 14.58,35.69 21.21,35.69 22.61,34.29 22.61,28.57 H_0X.P$5
N$92
  Top 0.305: R36.P$2 9.8,47.78 9.8,41.18 13.22,37.77 19.85,37.77 23.11,34.5 23.11,30.61 H_0X.P$4
N$93
  Top 0.305: R37.P$2 13.26,44.45 17.14,40.56 19.89,40.56 20.57,39.88 20.57,38.48 24.89,34.16 H_0X.P$2
N$94
  Top 0.305: R38.P$2 10.31,45.74 10.31,41.39 13.43,38.28 20.06,38.28 23.62,34.72 23.62,32.64 H_0X.P$3
N$96
  Top 0.305: IC16.9 R39.P$1
N$97
  Top 0.305: R40.P$1 IC16.10
N$98
  Top 0.305: IC16.11 R41.P$1
N$99
  Top 0.305: R42.P$1 IC16.12
N$100
  Top 0.305: IC16.13 R43.P$1
N$101
  Top 0.305: IC16.15 R45.P$1
N$102
  Top 0.305: R44.P$1 IC16.14
N$103
  Top 0.305: R39.P$2 56.01,5.33 56.01,20.19 52.7,23.49 52.7,28.43 51.95,29.18 48.5,29.18 41.23,36.45 H_X0.P$10
N$104
  Top 0.305: R40.P$2 55.5,7.37 55.5,19.98 50.04,25.44 50.04,27.56 48.92,28.68 48.28,28.68 43.05,33.91 H_X0.P$9
N$105
  Top 0.305: R41.P$2 54.99,9.4 54.99,19.77 50.12,24.64 43.18,24.64 41.4,26.42 41.4,30.35 H_X0.P$8
N$106
  Top 0.305: R42.P$2 51.44,12.95 51.44,20.45 49.28,22.61 39.88,22.61 36.2,26.29 H_X0.P$5
N$107
  Top 0.305: R43.P$2 51.94,14.99 51.94,20.66 49.49,23.11 40.18,23.11 35.05,28.24 H_X0.P$4
N$108
  Top 0.305: R45.P$2 53.72,20.32 49.91,24.13 40.6,24.13 36.83,27.9 36.83,32.26 35.05,34.04 H_X0.P$2
N$109
  Top 0.305: R44.P$2 52.45,17.02 52.45,20.87 49.7,23.62 40.39,23.62 36.32,27.69 36.32,30.35 H_X0.P$3
N$110
  Top 0.254: IC15.7 31.24,17.91 29.92,16.59 29.92,15.35 30.74,14.53 32.97,14.53 IC16.4
N$111
  Top 0.254: IC14.2 33.53,46.99 IC12.6
N$112
  Top 0.254: IC15.6 33.78,18.29 IC16.2
N$113
  Top 0.254: IC15.2 32.56,6.91 34.8,6.91 35.51,7.62 35.51,14.53 IC16.3
N$114
  Top 0.254: IC14.4 32.21,48.31 34.44,48.31 35.31,47.44 35.31,45.72 IC12.7 32.77,43.18 28.32,43.18 25.5,46 25.5,59.26 23.31,61.44 11.59,61.44 10.16,60.02 10.16,51.35 8.81,50.01 8.81,39.32 IC8.1
N$115
  Top 0.254: IC14.3 30.99,47.81 29.77,49.02 29.77,52.58 30.59,53.39 31.49,53.39 32.59,54.49 32.59,57.15 | IC8.2 8.76,36.7 | 8.76,36.7 8.6,36.7 7.34,37.97 7.34,49.18 9.7,51.55 9.7,60.21 11.4,61.9 11.43,61.9 31.19,61.9 32.59,60.5 32.59,57.15 | IC12.2 32.59,57.15 | 8.76,36.7 7.34,35.28 7.34,33.17 IC8.4
N$117  (via drill 0.35)
  Top 0.254: v41.27,21.84 41.27,10.85 34.8,4.37 26.62,4.37 IC15.14 22.86,8.3 21.29,9.86 21.18,9.97 21.18,13.27 11.18,23.27 11.18,24.26 IC8.6
  Bottom 0.254: v41.27,21.84 46.1,26.67 D1.A
N$118
  Top 0.254: IC8.5 9.14,29.08 21.64,16.59 21.64,10.16 22.36,9.45 29.92,9.45 IC15.3 33.78,10.67 IC16.5
SEC_MAJOR_C  (via drill 0.35)
  Top 0.254: v88.29,36.7 88.29,35.2 85.98,32.89 83.69,32.89 77.85,38.73 70.6,38.73 69.19,37.32 69.19,26.25 68.06,25.12 62,25.12 59.33,27.79 59.33,33.18 56.96,35.56 R9.P$1
  Top 0.305: IC6.14 117.6,54.59 113.81,50.8 105.66,50.8 104.9,50.04 104.9,49.04 105.66,48.28 106.66,48.28 107.42,47.52 107.42,31.85 105.66,30.1 99.52,30.1 97.66,31.96 97.66,33.78 94.74,36.7 IC1.6
  Bottom 0.254: v88.29,36.7 IC1.6
SEC_MINOR_C
  Top 0.305: IC3.14 96.55,9.37 96.55,18.07 91.06,23.55 91.06,28.19 91.95,29.08 IC1.3 93.34,29.08 98.42,24 106.93,24 108.97,26.04 108.97,38.99 111.12,41.15 111.12,47.62 IC6.5
VCC  (via drill 0.35)
  Top 0.305: R10.P$2 122.05,35.43 118.61,38.87
  Top 0.406: 119.62,45.09 IC2.8 121.67,42.8 C3.1 | IC2.4 128.65,54.1 JP1.1
  Top 0.508: C6.1 IC6.16 121.86,55.44 121.86,55.31 | IC6.13 IC6.12 IC6.11 | IC3.11 IC3.12 IC3.13 97.79,10.03 99.39,8.43 99.39,4.65 IC3.16 C4.1 | IC10.11 IC10.12 IC10.13 | IC15.11 IC15.12 IC15.13 IC15.4 | IC12.11 IC12.12 IC12.13 v39.37,52.07 | C8.1 79.88,59.82 IC7.16 | C17.1 IC8.14 | C13.1 IC14.16 | C14.1 IC15.16 | IC16.16 C15.1 | C10.1 IC10.16 | C16.1 82.42,24 IC1.14 | C11.1 IC11.16 | IC4.16 C5.1 | C7.1 IC5.16 | IC7.11 IC7.12 IC7.13 | v74.93,52.07 75.56,52.07 | 75.56,52.07 v76.2,52.07 | IC7.16 75.56,55.37 v75.56,53.47 75.56,52.07 | M_0X.P$1 60.07,38.86 IC9.16 C9.1 | 82.5,62.31 IC7.16 | IC12.4 v37.34,52.07 | C12.1 42.42,59.82 IC12.16
  Top 0.61: 119.06,52.51 121.86,55.31 127.51,60.96 JP1.1 127,62.61 C6.1 113.86,62.61 112.65,61.39 111.64,61.39 110.67,62.36 v103.12,62.36 102.36,62.36 | 119.06,52.51 118.62,52.07 IC6.13 | S_0X.P$1 111.89,38.1 v113.03,38.1 117.84,38.1 118.61,38.87 119.62,39.88 119.62,45.09 119.62,51.96 119.06,52.51 | 102.36,62.36 v101.35,62.36 82.55,62.36 | v102.23,60.96 102.23,62.23 102.36,62.36 | 82.55,62.36 82.5,62.31 | 82.55,62.36 77.34,62.36 C8.1 76.15,62.74 74.93,61.52 73.92,61.52 72.7,62.74 45.47,62.74 IC12.16 42.42,59.13 38.48,55.19 v38.48,53.21 38.48,52.07 | v37.34,52.07 38.48,52.07 | 38.48,52.07 v39.37,52.07
  Bottom 0.508: IC5.6 108.71,52.07 IC6.4 109.98,52.07 IC6.16 | IC4.16 117.6,24 S_0X.P$6 115.32,27 113,29.31 113,33.68 S_0X.P$1 | 101.47,22.61 S_X0.P$6 107.95,29.08 107.95,34.16 S_0X.P$1 | 101.47,22.61 100.41,21.54 100.41,19 97.79,16.38 IC3.11 | v113.03,38.1 111.89,38.1 S_0X.P$1 | M_X0.P$6 74.48,26.29 73.18,24.99 72.11,24.99 70.81,26.29 M_0X.P$6 65.53,26.29 | IC9.6 68.96,54.61 IC7.4 v74.93,52.07 75.56,52.07 | 75.56,52.07 v76.2,52.07 IC7.13 | v75.56,53.47 75.56,52.07 | M_0X.P$1 64.58,38.54 | 64.58,38.54 64.95,38.91 69.6,38.91 | 69.6,38.91 72.57,38.91 75.56,41.91 75.56,52.07 | 64.58,38.54 64.83,38.54 65.53,37.85 65.53,26.29 | IC10.11 65.53,20.95 65.53,23.11 | 65.53,23.11 65.53,26.29 | 101.47,22.61 98.75,25.32 91.41,25.32 90.08,24 IC1.14 84.58,24 81.41,20.83 IC11.16 | IC11.6 71.25,8.13 IC10.4 64.52,10.67 | IC10.13 64.52,10.67 | IC10.16 64.52,7.24 64.52,10.67 | IC3.13 102.11,10.67 | 102.11,10.67 IC3.4 106.68,10.67 IC4.6 | IC3.16 102.11,7.37 102.11,10.67 | C15.1 48.39,23.11 65.53,23.11 | IC15.4 33.78,8.13 IC16.6 | IC15.13 22.86,10.03 24.21,8.69 24.21,4.39 IC15.16 | IC14.6 33.53,52.07 IC12.4 | v37.34,52.07 38.48,52.07 | v39.37,52.07 38.48,52.07 | v38.48,53.21 38.48,52.07 | 38.48,52.07 38.48,40.13 36.64,38.29 | H_X0.P$1 35.05,36.7 36.64,38.29 | IC8.14 17.65,39.24 18.95,40.54 21.49,40.54 22.86,41.91 IC14.16 24.26,41.91 24.89,41.27 24.89,39.12 | H_0X.P$1 24.89,39.12 | IC15.11 29.97,22.86 H_0X.P$6 33.22,26.29 34.52,24.99 35.72,24.99 37.01,26.29 H_X0.P$6 40.13,21.72 41.02,20.83 IC16.16 | 36.64,38.29 35.81,39.12 24.89,39.12 | M_X0.P$1 70.74,36.45 69.6,37.59 69.6,38.91 | 102.23,41.91 102.23,38.61 S_X0.P$1 | IC5.16 102.23,41.91
  Bottom 0.508: 102.23,41.91 v102.23,60.96 102.23,62.23 102.11,62.36 | v101.35,62.36 102.11,62.36 | 102.11,62.36 v103.12,62.36

### Text on the board
tPlace: + | - | Derek Nash / Isaac Rex / Rev: 0 | Hours | Minutes
tNames: Frequency / Calibrate